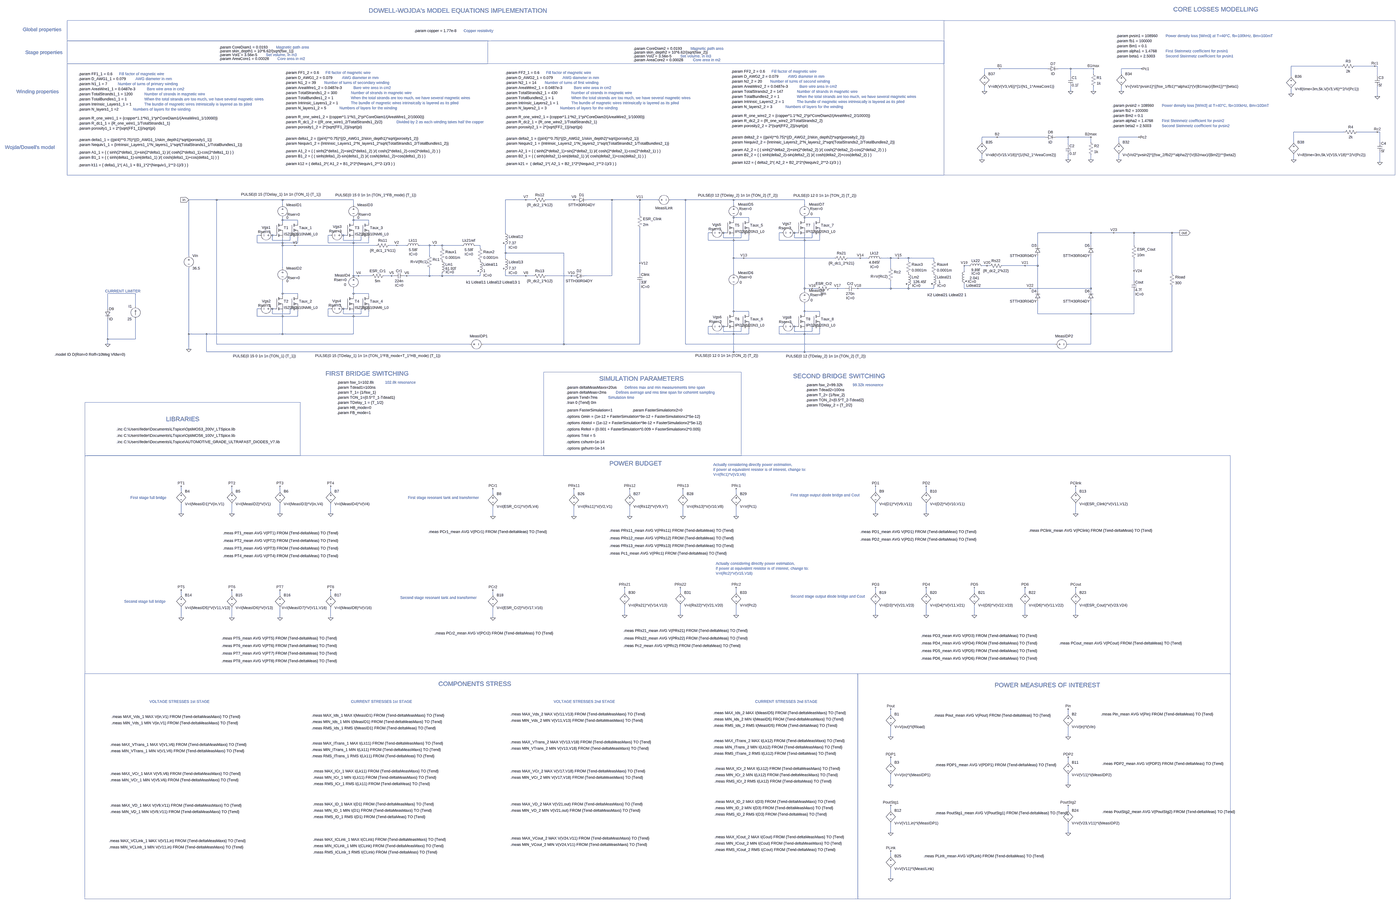
[diagram p0: schematic LLC_IPOS_quadratic_V14.asc, whole sheet]
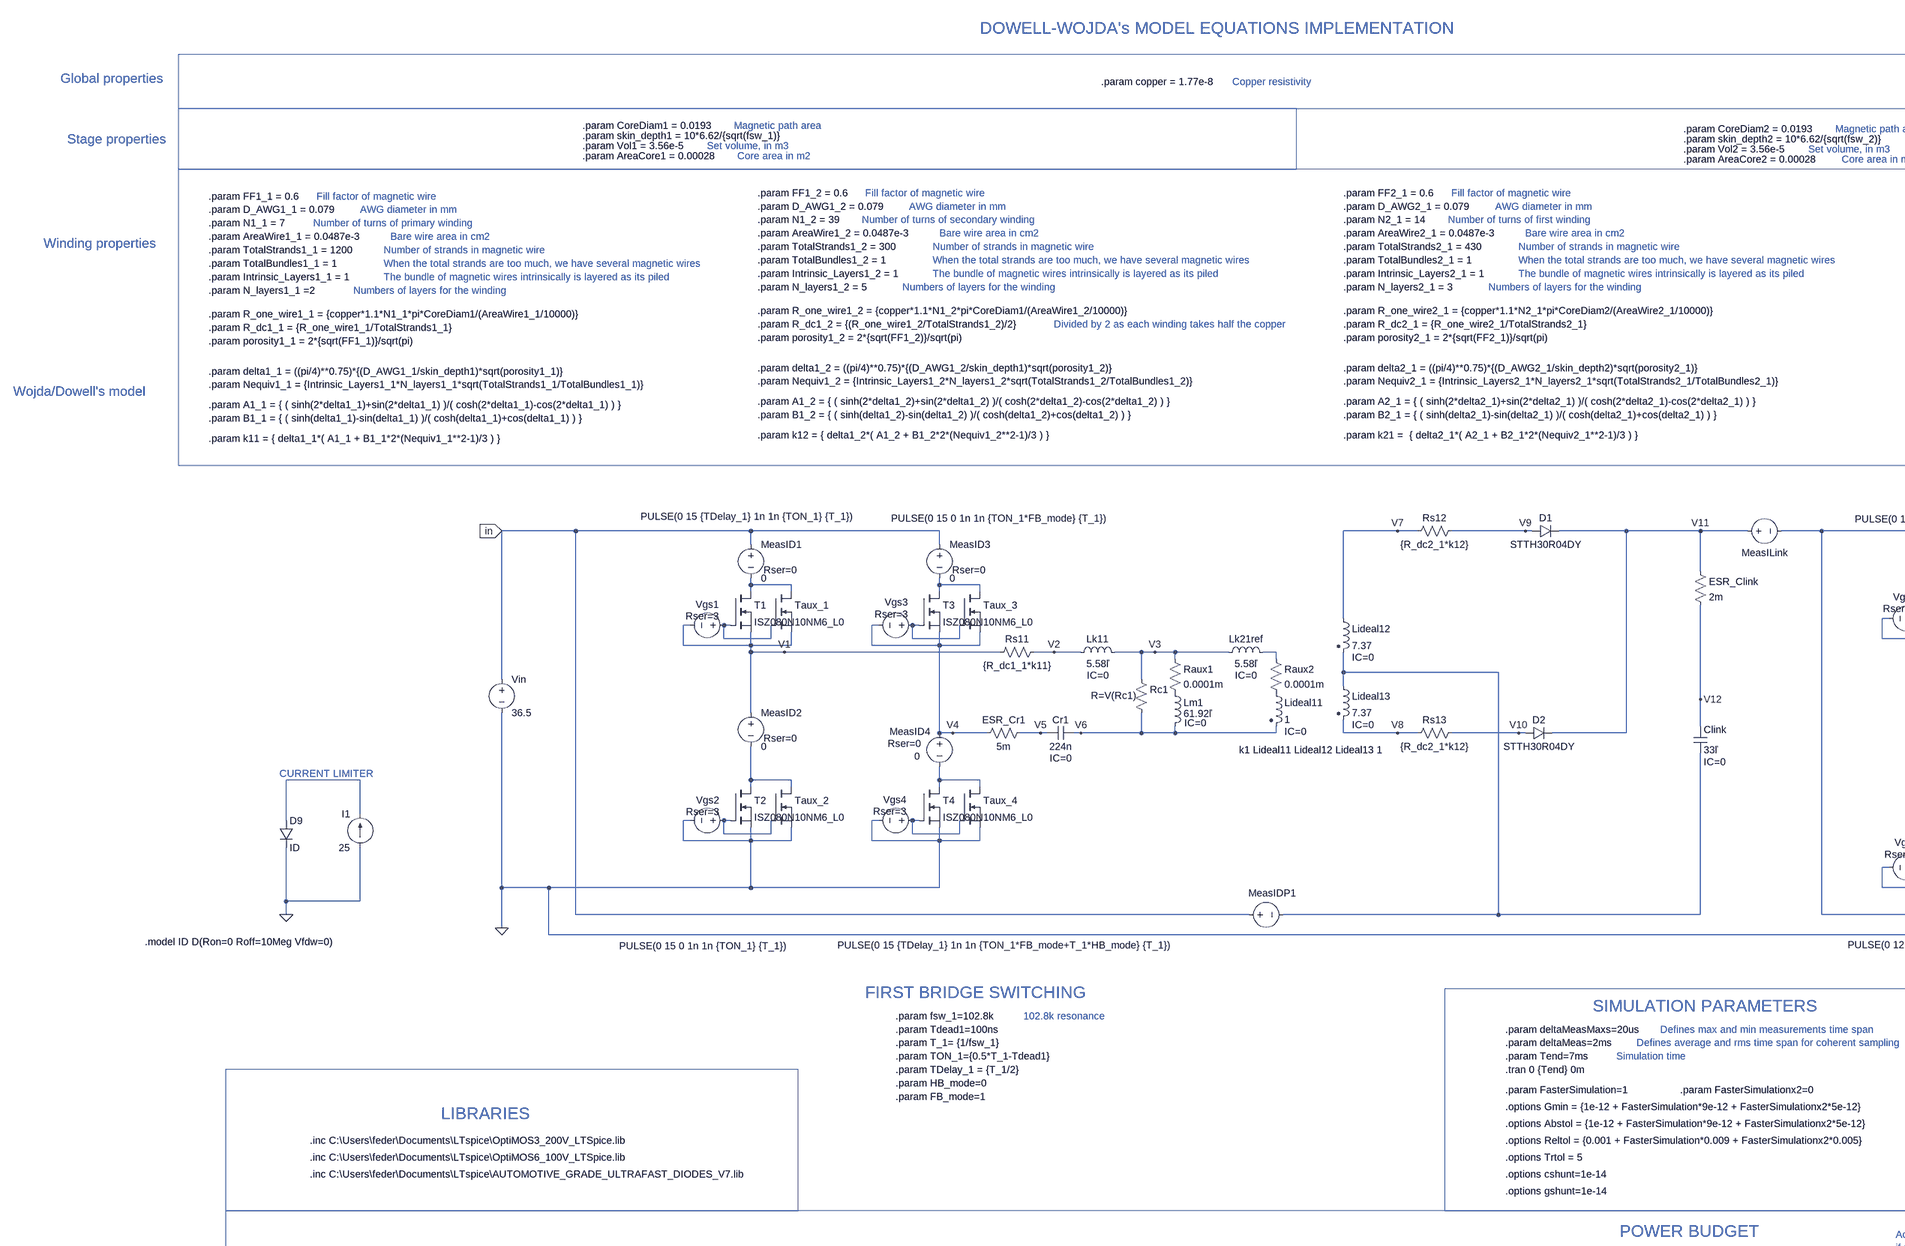
[diagram p1: schematic LLC_IPOS_quadratic_V14.asc, part, row 1 of 2, column 1 of 2]
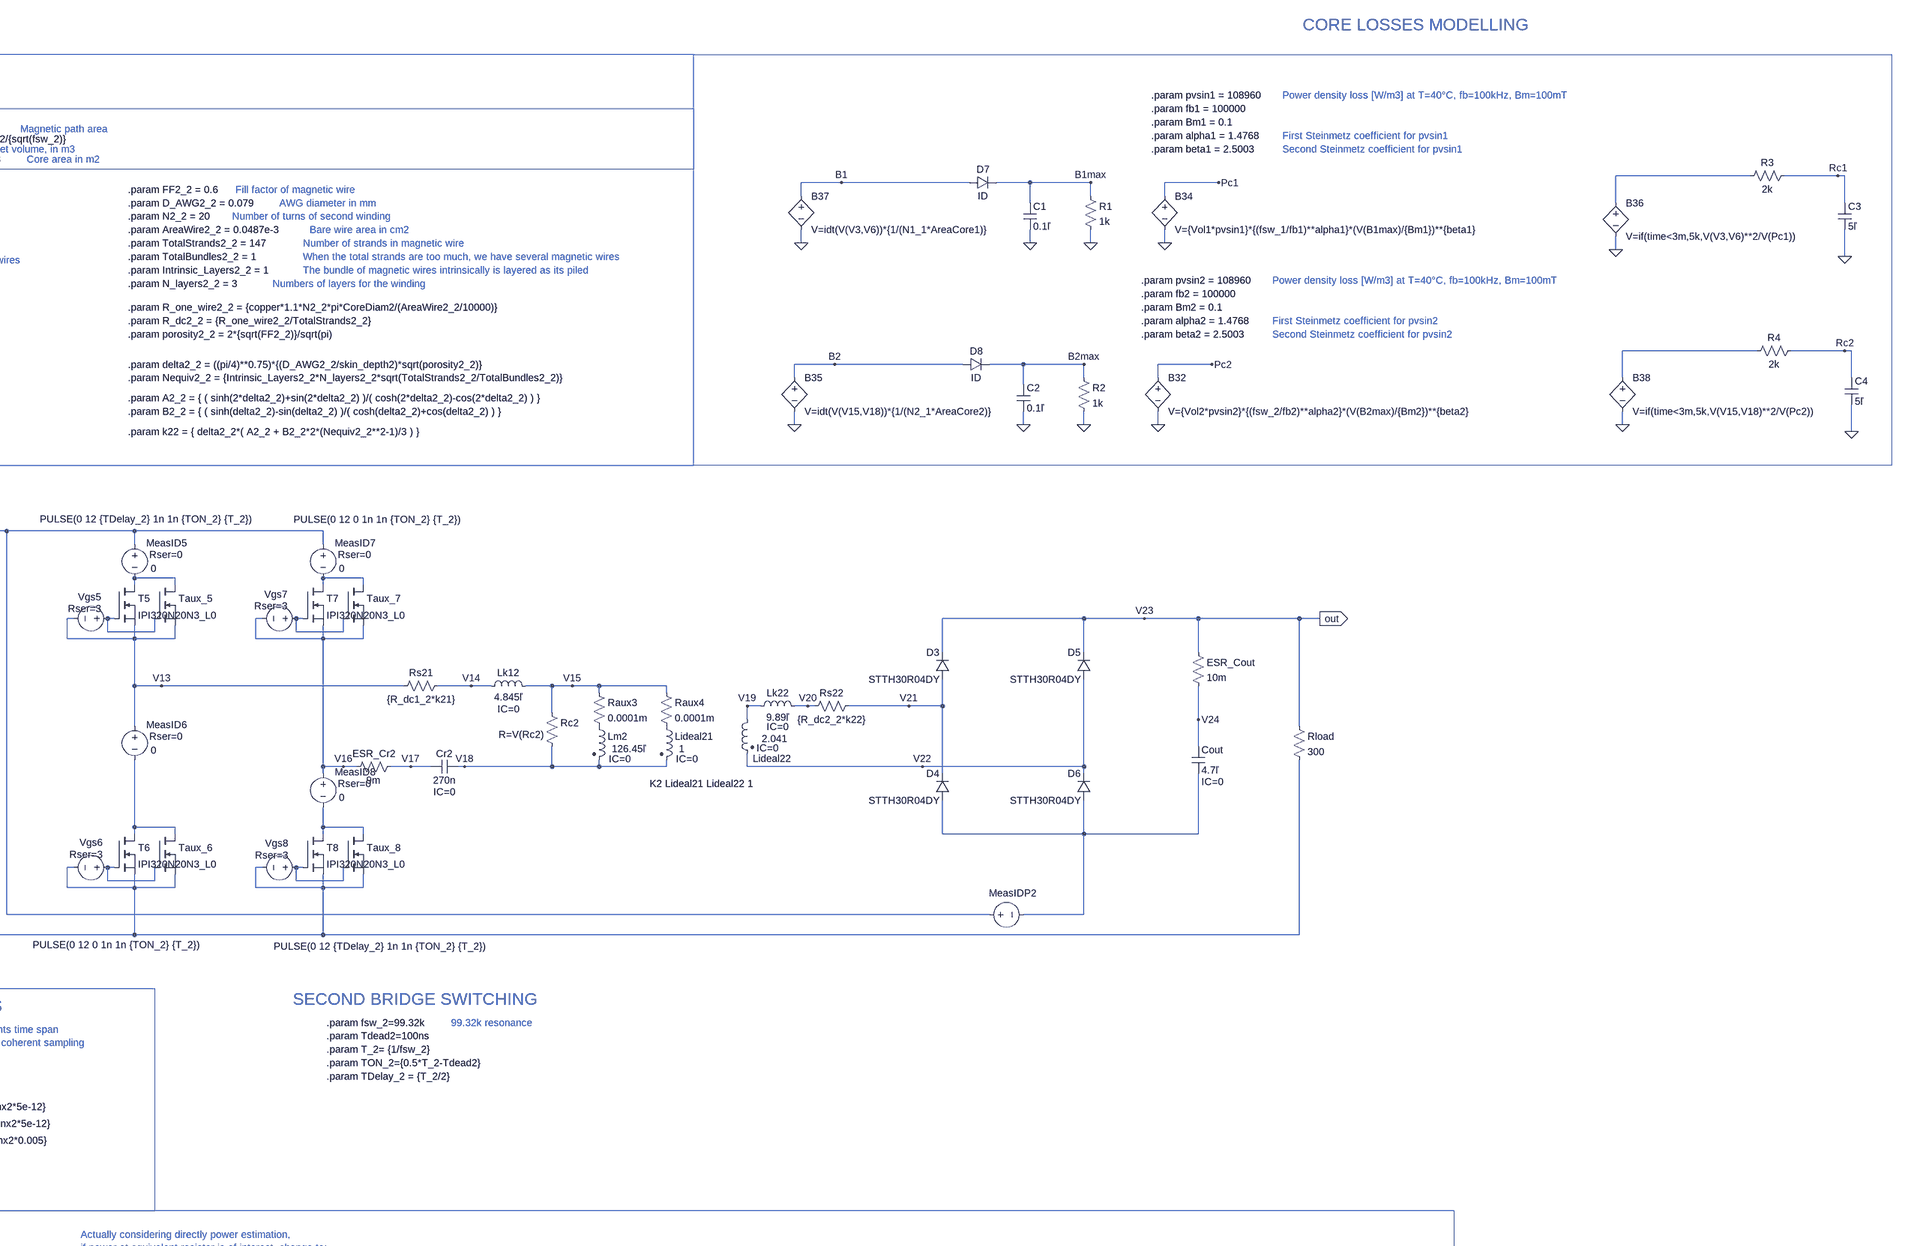
[diagram p2: schematic LLC_IPOS_quadratic_V14.asc, part, row 1 of 2, column 2 of 2]
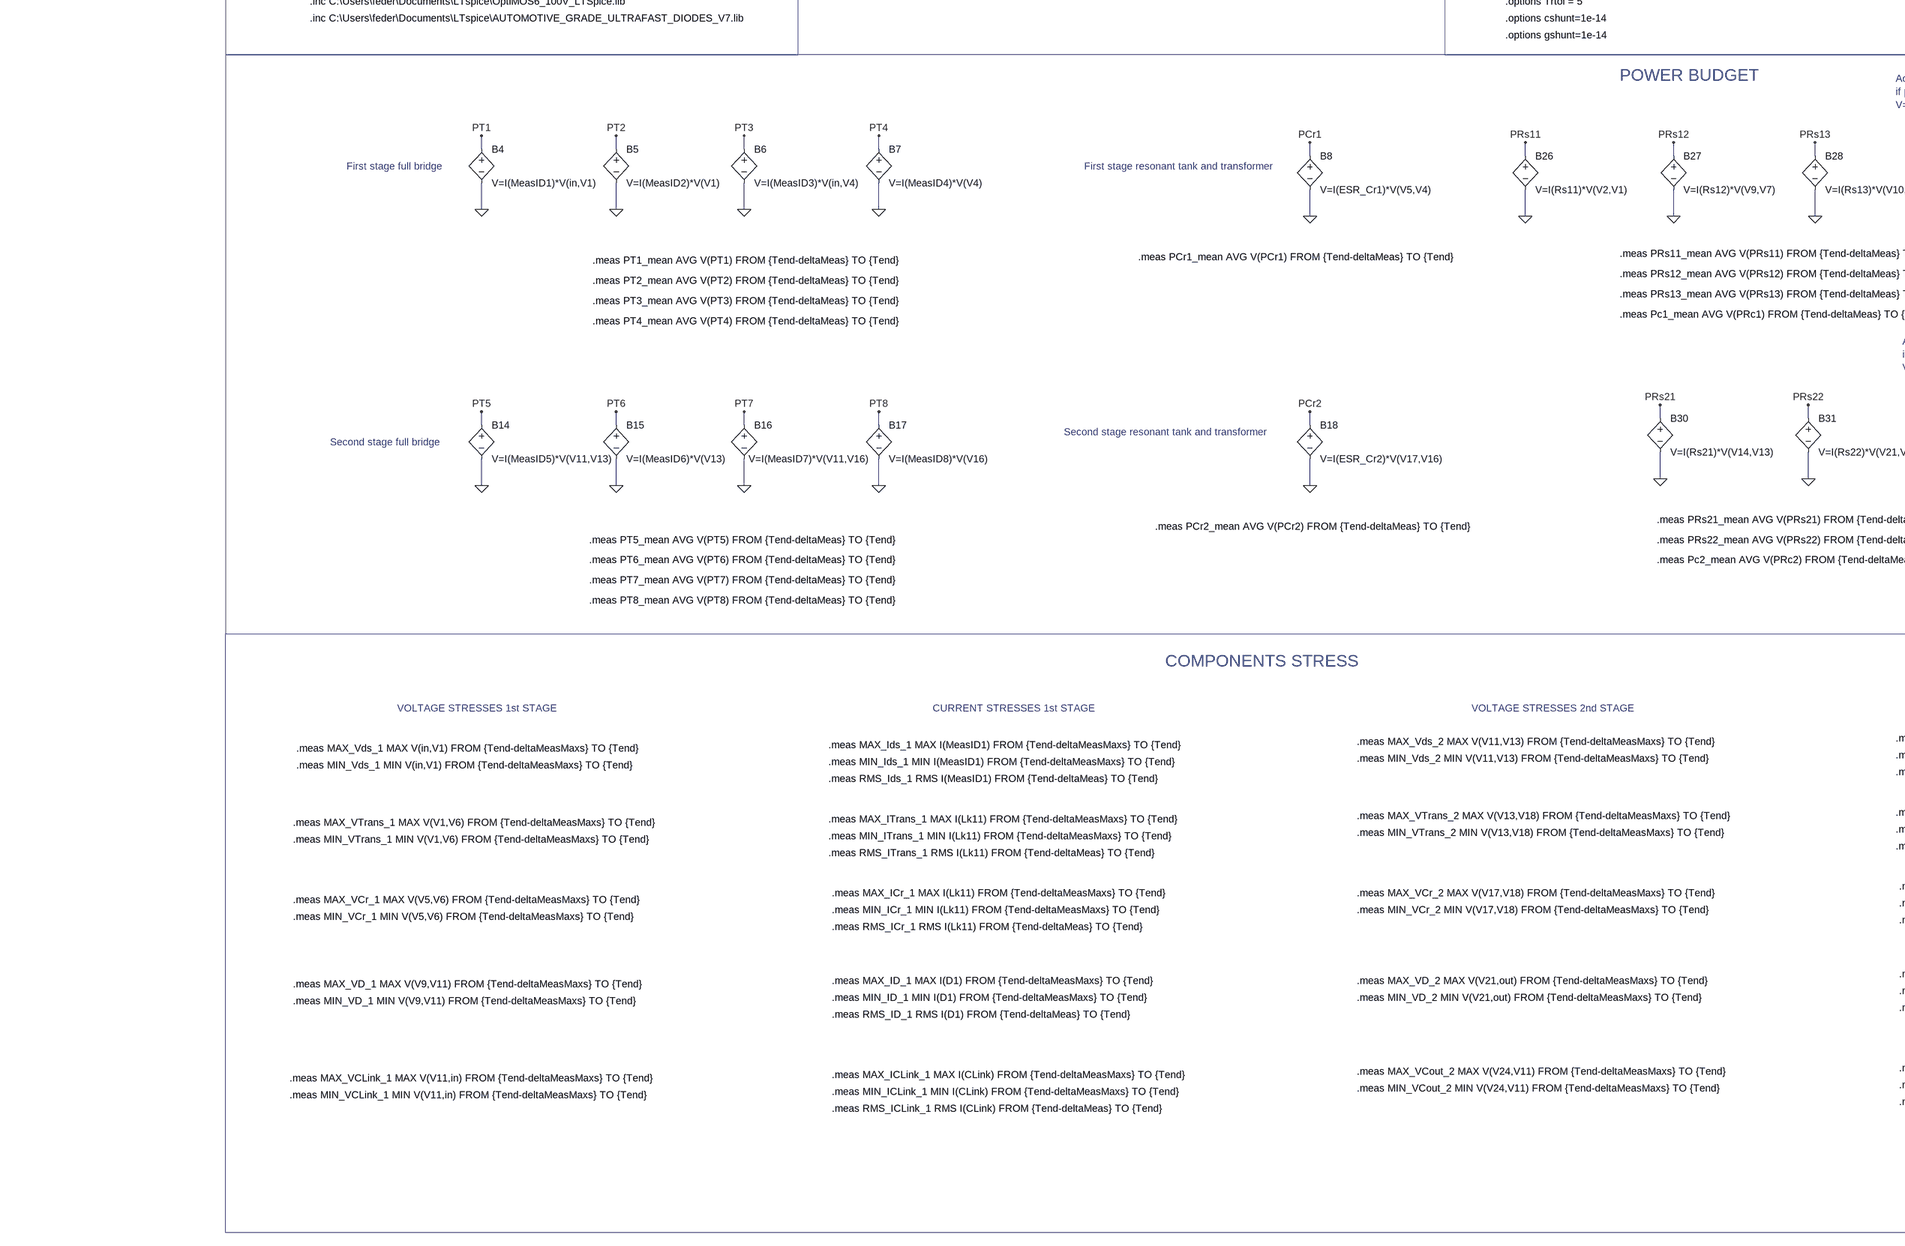
[diagram p3: schematic LLC_IPOS_quadratic_V14.asc, part, row 2 of 2, column 1 of 2]
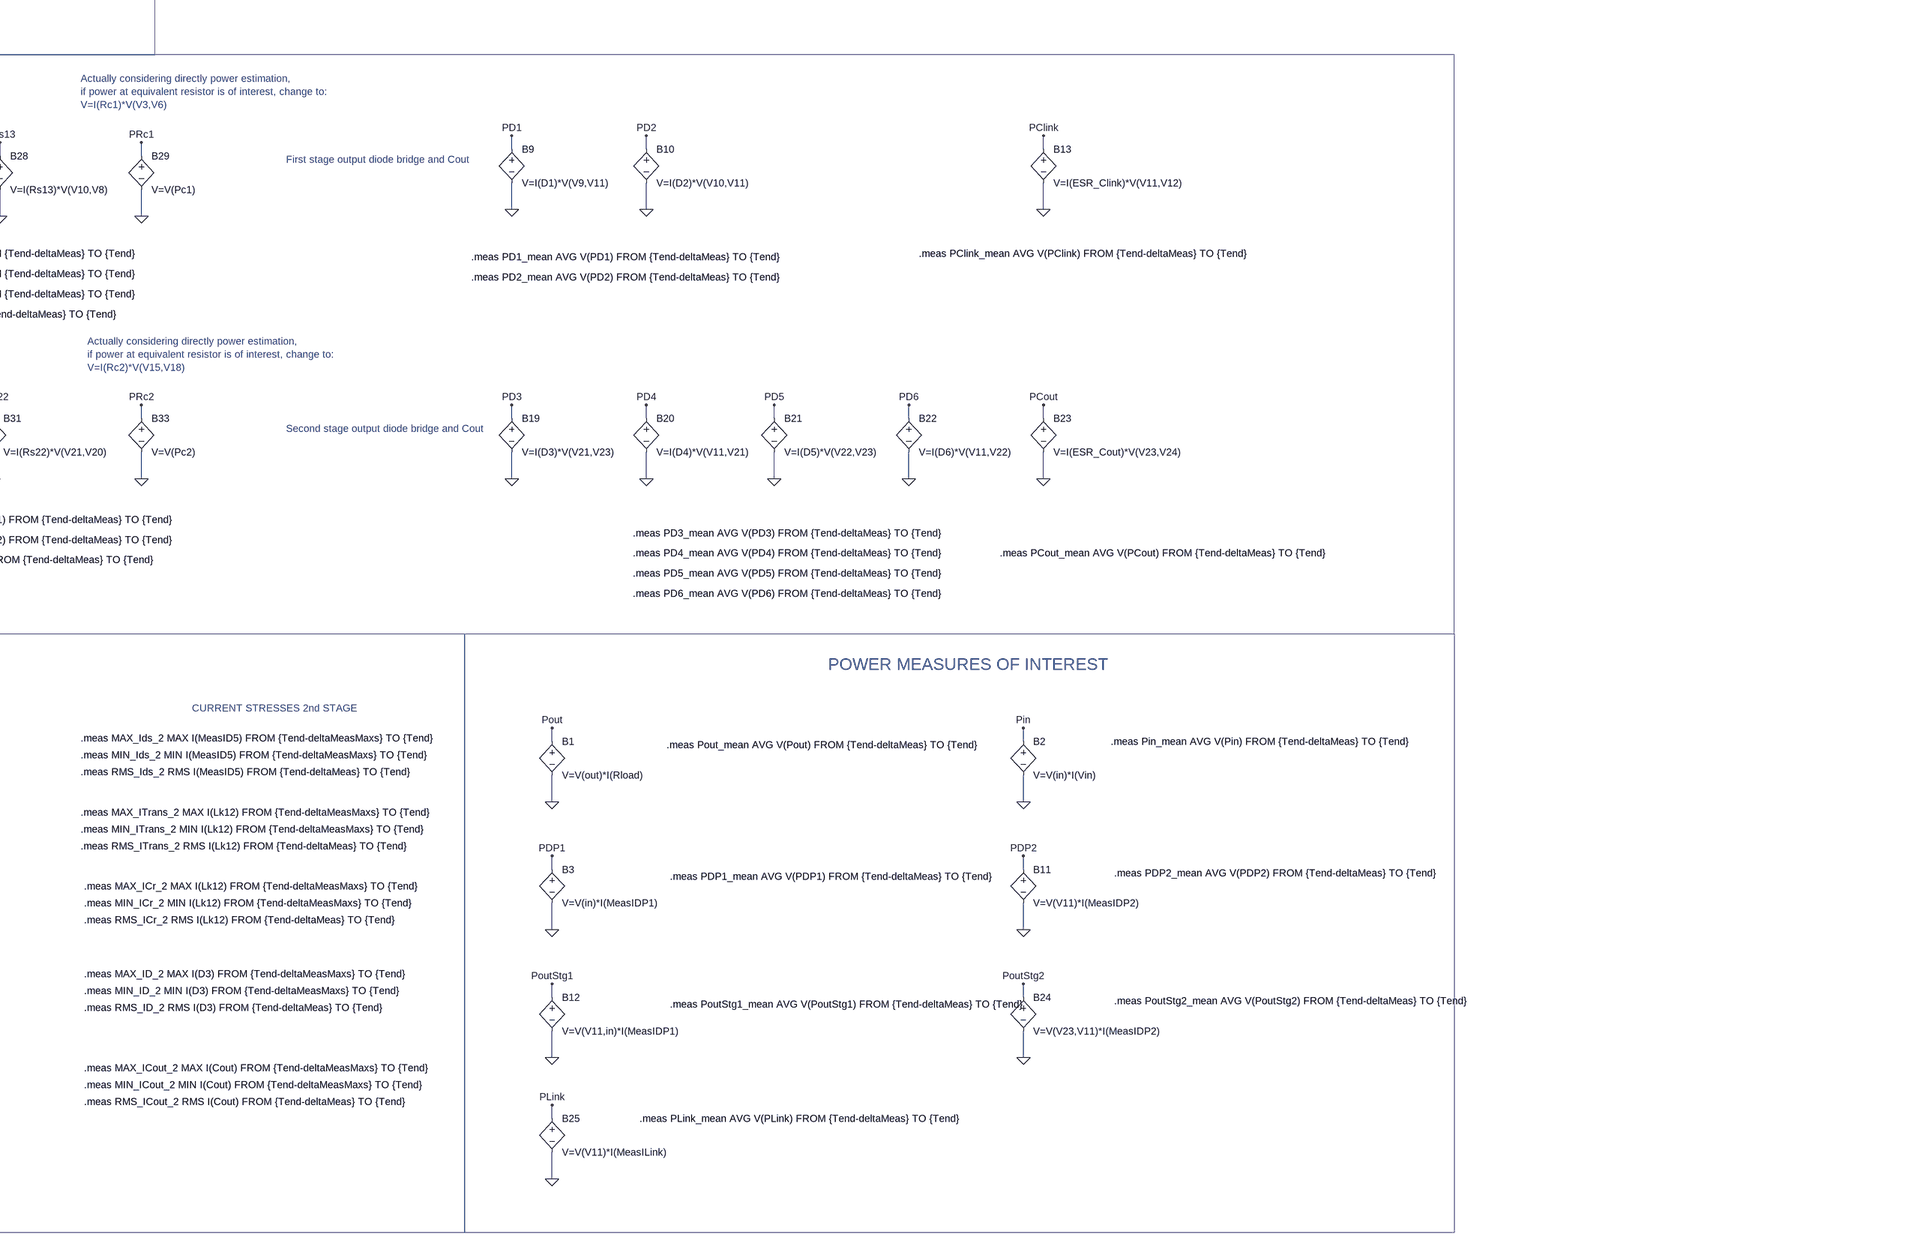
[diagram p4: schematic LLC_IPOS_quadratic_V14.asc, part, row 2 of 2, column 2 of 2]
* LLC_IPOS_quadratic_V14.asc
XT6 N019 N022 0 IPI320N20N3_L0  ; pins D G S
Vgs6 N022 0 PULSE(0 12 0 1n 1n {TON_2} {T_2}) Rser=3
Vin in 0 36.5
Rload V23 0 300
Cr2 V18 V17 270n IC=0
D3 V21 V23 STTH30R04DY
XT5 N004 N008 V13 IPI320N20N3_L0  ; pins D G S
XT7 N005 N009 V16 IPI320N20N3_L0  ; pins D G S
XT8 N020 N023 0 IPI320N20N3_L0  ; pins D G S
Lideal22 V19 V22 2.041 IC=0
Lideal21 P001 V18 1 IC=0
Vgs7 N009 V16 PULSE(0 12 0 1n 1n {TON_2} {T_2}) Rser=3
Vgs5 N008 V13 PULSE(0 12 {TDelay_2} 1n 1n {TON_2} {T_2}) Rser=3
Vgs8 N023 0 PULSE(0 12 {TDelay_2} 1n 1n {TON_2} {T_2}) Rser=3
D5 V22 V23 STTH30R04DY
D4 N021 V21 STTH30R04DY
D6 N021 V22 STTH30R04DY
Cout V24 N021 4.7ľ IC=0
B1 Pout 0 V=V(out)*I(Rload)
B2 Pin 0 V=V(in)*I(Vin)
XT2 N015 N017 0 ISZ080N10NM6_L0  ; pins D G S
Vgs2 N017 0 PULSE(0 15 0 1n 1n {TON_1} {T_1}) Rser=3
Cr1 V6 V5 224n IC=0
XT1 N006 N010 V1 ISZ080N10NM6_L0  ; pins D G S
XT3 N007 N011 V4 ISZ080N10NM6_L0  ; pins D G S
XT4 N016 N018 0 ISZ080N10NM6_L0  ; pins D G S
Vgs3 N011 V4 PULSE(0 15 0 1n 1n {TON_1*FB_mode} {T_1}) Rser=3
Vgs1 N010 V1 PULSE(0 15 {TDelay_1} 1n 1n {TON_1} {T_1}) Rser=3
Vgs4 N018 0 PULSE(0 15 {TDelay_1} 1n 1n {TON_1*FB_mode+T_1*HB_mode} {T_1}) Rser=3
Clink V12 N013 33ľ IC=0
D9 N014 0 ID
I1 0 N014 25
R§ESR_Clink V11 V12 2m
R§ESR_Cout V23 V24 10m
R§ESR_Cr1 V5 V4 5m
R§ESR_Cr2 V17 V16 9m
B4 PT1 0 V=I(MeasID1)*V(in,V1)
V§MeasID1 in N006 0 Rser=0
V§MeasID2 V1 N015 0 Rser=0
V§MeasID3 in N007 0 Rser=0
V§MeasID4 V4 N016 0 Rser=0
V§MeasID5 N003 N004 0 Rser=0
V§MeasID6 V13 N019 0 Rser=0
V§MeasID7 N003 N005 0 Rser=0
V§MeasID8 V16 N020 0 Rser=0
B5 PT2 0 V=I(MeasID2)*V(V1)
B6 PT3 0 V=I(MeasID3)*V(in,V4)
B7 PT4 0 V=I(MeasID4)*V(V4)
B8 PCr1 0 V=I(ESR_Cr1)*V(V5,V4)
B9 PD1 0 V=I(D1)*V(V9,V11)
B10 PD2 0 V=I(D2)*V(V10,V11)
B13 PClink 0 V=I(ESR_Clink)*V(V11,V12)
B14 PT5 0 V=I(MeasID5)*V(V11,V13)
B15 PT6 0 V=I(MeasID6)*V(V13)
B16 PT7 0 V=I(MeasID7)*V(V11,V16)
B17 PT8 0 V=I(MeasID8)*V(V16)
B18 PCr2 0 V=I(ESR_Cr2)*V(V17,V16)
B19 PD3 0 V=I(D3)*V(V21,V23)
B20 PD4 0 V=I(D4)*V(V11,V21)
B21 PD5 0 V=I(D5)*V(V22,V23)
B22 PD6 0 V=I(D6)*V(V11,V22)
B23 PCout 0 V=I(ESR_Cout)*V(V23,V24)
D1 V9 V11 STTH30R04DY
D2 V10 V11 STTH30R04DY
V§MeasIDP1 in N013 0 Rser=0
V§MeasIDP2 N003 N021 0 Rser=0
B3 PDP1 0 V=V(in)*I(MeasIDP1)
B11 PDP2 0 V=V(V11)*I(MeasIDP2)
B12 PoutStg1 0 V=V(V11,in)*I(MeasIDP1)
B24 PoutStg2 0 V=V(V23,V11)*I(MeasIDP2)
V§MeasILink V11 N003 0 Rser=0
B25 PLink 0 V=V(V11)*I(MeasILink)
Lk11 V2 V3 5.58ľ IC=0
Lm1 P002 V6 61.92ľ IC=0
Raux1 V3 P002 0.0001m
Lk21ref V3 N012 5.58ľ IC=0
Raux2 N012 P003 0.0001m
Lideal11 P003 V6 1 IC=0
Lideal12 V7 N013 7.37 IC=0
Lideal13 N013 V8 7.37 IC=0
Lk12 V14 V15 4.845ľ IC=0
Lm2 P004 V18 126.45ľ IC=0
Raux3 V15 P004 0.0001m
Raux4 V15 P001 0.0001m
Lk22 V19 V20 9.89ľ IC=0
Rs11 V2 V1 {R_dc1_1*k11}
Rs12 V9 V7 {R_dc2_1*k12}
Rs13 V10 V8 {R_dc2_1*k12}
Rs22 V21 V20 {R_dc2_2*k22}
Rc1 V3 V6 R=V(Rc1)
Rc2 V15 V18 R=V(Rc2)
Rs21 V14 V13 {R_dc1_2*k21}
B26 PRs11 0 V=I(Rs11)*V(V2,V1)
B27 PRs12 0 V=I(Rs12)*V(V9,V7)
B28 PRs13 0 V=I(Rs13)*V(V10,V8)
B29 PRc1 0 V=V(Pc1)
B30 PRs21 0 V=I(Rs21)*V(V14,V13)
B31 PRs22 0 V=I(Rs22)*V(V21,V20)
B33 PRc2 0 V=V(Pc2)
B34 Pc1 0 V={Vol1*pvsin1}*{(fsw_1/fb1)**alpha1}*(V(B1max)/{Bm1})**{beta1}
B37 B1 0 V=idt(V(V3,V6))*{1/(N1_1*AreaCore1)}
D7 B1 B1max ID
C1 B1max 0 0.1ľ
R1 B1max 0 1k
B32 Pc2 0 V={Vol2*pvsin2}*{(fsw_2/fb2)**alpha2}*(V(B2max)/{Bm2})**{beta2}
B35 B2 0 V=idt(V(V15,V18))*{1/(N2_1*AreaCore2)}
D8 B2 B2max ID
C2 B2max 0 0.1ľ
R2 B2max 0 1k
B36 N001 0 V=if(time<3m,5k,V(V3,V6)**2/V(Pc1))
R3 Rc1 N001 2k
C3 Rc1 0 5ľ
B38 N002 0 V=if(time<3m,5k,V(V15,V18)**2/V(Pc2))
R4 Rc2 N002 2k
C4 Rc2 0 5ľ
XTaux_1 N006 N010 V1 ISZ080N10NM6_L0  ; pins D G S
XTaux_3 N007 N011 V4 ISZ080N10NM6_L0  ; pins D G S
XTaux_2 N015 N017 0 ISZ080N10NM6_L0  ; pins D G S
XTaux_4 N016 N018 0 ISZ080N10NM6_L0  ; pins D G S
XTaux_5 N004 N008 V13 IPI320N20N3_L0  ; pins D G S
XTaux_7 N005 N009 V16 IPI320N20N3_L0  ; pins D G S
XTaux_6 N019 N022 0 IPI320N20N3_L0  ; pins D G S
XTaux_8 N020 N023 0 IPI320N20N3_L0  ; pins D G S
.model D D
.lib standard.dio
.inc C:\Users\feder\Documents\LTspice\OptiMOS3_200V_LTSpice.lib
.inc C:\Users\feder\Documents\LTspice\OptiMOS6_100V_LTSpice.lib
K2 Lideal21 Lideal22 1
.param fsw_1=102.8k
.param T_1= {1/fsw_1}
.param TON_1={0.5*T_1-Tdead1}
.param TDelay_1 = {T_1/2}
.param T_2= {1/fsw_2}
.param TON_2={0.5*T_2-Tdead2}
.param TDelay_2 = {T_2/2}
.param fsw_2=99.32k
.param HB_mode=0
.param FB_mode=1
.model ID D(Ron=0 Roff=10Meg Vfdw=0)
* POWER BUDGET
* CURRENT LIMITER
* First stage full bridge
* First stage resonant tank and transformer
* First stage output diode bridge and Cout
* Second stage full bridge
* Second stage resonant tank and transformer
* Second stage output diode bridge and Cout
.meas PT1_mean AVG V(PT1) FROM {Tend-deltaMeas} TO {Tend}
.meas PT2_mean AVG V(PT2) FROM {Tend-deltaMeas} TO {Tend}
.meas PT3_mean AVG V(PT3) FROM {Tend-deltaMeas} TO {Tend}
.meas PT4_mean AVG V(PT4) FROM {Tend-deltaMeas} TO {Tend}
.meas PT5_mean AVG V(PT5) FROM {Tend-deltaMeas} TO {Tend}
.meas PT6_mean AVG V(PT6) FROM {Tend-deltaMeas} TO {Tend}
.meas PT7_mean AVG V(PT7) FROM {Tend-deltaMeas} TO {Tend}
.meas PT8_mean AVG V(PT8) FROM {Tend-deltaMeas} TO {Tend}
.meas PCr1_mean AVG V(PCr1) FROM {Tend-deltaMeas} TO {Tend}
.meas PCr2_mean AVG V(PCr2) FROM {Tend-deltaMeas} TO {Tend}
.meas PD1_mean AVG V(PD1) FROM {Tend-deltaMeas} TO {Tend}
.meas PD2_mean AVG V(PD2) FROM {Tend-deltaMeas} TO {Tend}
.meas PD3_mean AVG V(PD3) FROM {Tend-deltaMeas} TO {Tend}
.meas PD4_mean AVG V(PD4) FROM {Tend-deltaMeas} TO {Tend}
.meas PD5_mean AVG V(PD5) FROM {Tend-deltaMeas} TO {Tend}
.meas PD6_mean AVG V(PD6) FROM {Tend-deltaMeas} TO {Tend}
.meas PClink_mean AVG V(PClink) FROM {Tend-deltaMeas} TO {Tend}
.meas PCout_mean AVG V(PCout) FROM {Tend-deltaMeas} TO {Tend}
.meas Pout_mean AVG V(Pout) FROM {Tend-deltaMeas} TO {Tend}
.meas Pin_mean AVG V(Pin) FROM {Tend-deltaMeas} TO {Tend}
.param Tdead1=100ns
.param Tdead2=100ns
.tran 0 {Tend} 0m
.param Tend=7ms
.param FasterSimulation=1
* POWER MEASURES OF INTEREST
.meas PDP1_mean AVG V(PDP1) FROM {Tend-deltaMeas} TO {Tend}
.meas PDP2_mean AVG V(PDP2) FROM {Tend-deltaMeas} TO {Tend}
.meas PoutStg1_mean AVG V(PoutStg1) FROM {Tend-deltaMeas} TO {Tend}
.meas PoutStg2_mean AVG V(PoutStg2) FROM {Tend-deltaMeas} TO {Tend}
.param deltaMeas=2ms
* Defines average and rms time span for coherent sampling
.meas PLink_mean AVG V(PLink) FROM {Tend-deltaMeas} TO {Tend}
* VOLTAGE STRESSES 1st STAGE
.meas MAX_Vds_1 MAX V(in,V1) FROM {Tend-deltaMeasMaxs} TO {Tend}
.meas MIN_Vds_1 MIN V(in,V1) FROM {Tend-deltaMeasMaxs} TO {Tend}
.meas MAX_VTrans_1 MAX V(V1,V6) FROM {Tend-deltaMeasMaxs} TO {Tend}
.meas MIN_VTrans_1 MIN V(V1,V6) FROM {Tend-deltaMeasMaxs} TO {Tend}
.meas MAX_VCr_1 MAX V(V5,V6) FROM {Tend-deltaMeasMaxs} TO {Tend}
.meas MIN_VCr_1 MIN V(V5,V6) FROM {Tend-deltaMeasMaxs} TO {Tend}
.meas MAX_VD_1 MAX V(V9,V11) FROM {Tend-deltaMeasMaxs} TO {Tend}
.meas MIN_VD_1 MIN V(V9,V11) FROM {Tend-deltaMeasMaxs} TO {Tend}
.meas MAX_VCLink_1 MAX V(V11,in) FROM {Tend-deltaMeasMaxs} TO {Tend}
.meas MIN_VCLink_1 MIN V(V11,in) FROM {Tend-deltaMeasMaxs} TO {Tend}
.meas MAX_Vds_2 MAX V(V11,V13) FROM {Tend-deltaMeasMaxs} TO {Tend}
.meas MIN_Vds_2 MIN V(V11,V13) FROM {Tend-deltaMeasMaxs} TO {Tend}
.meas MAX_VTrans_2 MAX V(V13,V18) FROM {Tend-deltaMeasMaxs} TO {Tend}
.meas MIN_VTrans_2 MIN V(V13,V18) FROM {Tend-deltaMeasMaxs} TO {Tend}
.meas MAX_VCr_2 MAX V(V17,V18) FROM {Tend-deltaMeasMaxs} TO {Tend}
.meas MIN_VCr_2 MIN V(V17,V18) FROM {Tend-deltaMeasMaxs} TO {Tend}
.meas MAX_VD_2 MAX V(V21,out) FROM {Tend-deltaMeasMaxs} TO {Tend}
.meas MIN_VD_2 MIN V(V21,out) FROM {Tend-deltaMeasMaxs} TO {Tend}
.meas MAX_VCout_2 MAX V(V24,V11) FROM {Tend-deltaMeasMaxs} TO {Tend}
.meas MIN_VCout_2 MIN V(V24,V11) FROM {Tend-deltaMeasMaxs} TO {Tend}
.param deltaMeasMaxs=20us
* Defines max and min measurements time span
* CURRENT STRESSES 1st STAGE
.meas MAX_Ids_1 MAX I(MeasID1) FROM {Tend-deltaMeasMaxs} TO {Tend}
.meas MIN_Ids_1 MIN I(MeasID1) FROM {Tend-deltaMeasMaxs} TO {Tend}
.meas RMS_Ids_1 RMS I(MeasID1) FROM {Tend-deltaMeas} TO {Tend}
.meas MAX_ITrans_1 MAX I(Lk11) FROM {Tend-deltaMeasMaxs} TO {Tend}
.meas MIN_ITrans_1 MIN I(Lk11) FROM {Tend-deltaMeasMaxs} TO {Tend}
.meas RMS_ITrans_1 RMS I(Lk11) FROM {Tend-deltaMeas} TO {Tend}
.meas MAX_ICr_1 MAX I(Lk11) FROM {Tend-deltaMeasMaxs} TO {Tend}
.meas MIN_ICr_1 MIN I(Lk11) FROM {Tend-deltaMeasMaxs} TO {Tend}
.meas RMS_ICr_1 RMS I(Lk11) FROM {Tend-deltaMeas} TO {Tend}
.meas MAX_ID_1 MAX I(D1) FROM {Tend-deltaMeasMaxs} TO {Tend}
.meas MIN_ID_1 MIN I(D1) FROM {Tend-deltaMeasMaxs} TO {Tend}
.meas RMS_ID_1 RMS I(D1) FROM {Tend-deltaMeas} TO {Tend}
.meas MAX_ICLink_1 MAX I(CLink) FROM {Tend-deltaMeasMaxs} TO {Tend}
.meas MIN_ICLink_1 MIN I(CLink) FROM {Tend-deltaMeasMaxs} TO {Tend}
.meas RMS_ICLink_1 RMS I(CLink) FROM {Tend-deltaMeas} TO {Tend}
* VOLTAGE STRESSES 2nd STAGE
* CURRENT STRESSES 2nd STAGE
.meas MAX_Ids_2 MAX I(MeasID5) FROM {Tend-deltaMeasMaxs} TO {Tend}
.meas MIN_Ids_2 MIN I(MeasID5) FROM {Tend-deltaMeasMaxs} TO {Tend}
.meas RMS_Ids_2 RMS I(MeasID5) FROM {Tend-deltaMeas} TO {Tend}
.meas MAX_ITrans_2 MAX I(Lk12) FROM {Tend-deltaMeasMaxs} TO {Tend}
.meas MIN_ITrans_2 MIN I(Lk12) FROM {Tend-deltaMeasMaxs} TO {Tend}
.meas RMS_ITrans_2 RMS I(Lk12) FROM {Tend-deltaMeas} TO {Tend}
.meas MAX_ICr_2 MAX I(Lk12) FROM {Tend-deltaMeasMaxs} TO {Tend}
.meas MIN_ICr_2 MIN I(Lk12) FROM {Tend-deltaMeasMaxs} TO {Tend}
.meas RMS_ICr_2 RMS I(Lk12) FROM {Tend-deltaMeas} TO {Tend}
.meas MAX_ID_2 MAX I(D3) FROM {Tend-deltaMeasMaxs} TO {Tend}
.meas MIN_ID_2 MIN I(D3) FROM {Tend-deltaMeasMaxs} TO {Tend}
.meas RMS_ID_2 RMS I(D3) FROM {Tend-deltaMeas} TO {Tend}
.meas MAX_ICout_2 MAX I(Cout) FROM {Tend-deltaMeasMaxs} TO {Tend}
.meas MIN_ICout_2 MIN I(Cout) FROM {Tend-deltaMeasMaxs} TO {Tend}
.meas RMS_ICout_2 RMS I(Cout) FROM {Tend-deltaMeas} TO {Tend}
.options Gmin = {1e-12 + FasterSimulation*9e-12 + FasterSimulationx2*5e-12}
.options Abstol = {1e-12 + FasterSimulation*9e-12 + FasterSimulationx2*5e-12}
.options Reltol = {0.001 + FasterSimulation*0.009 + FasterSimulationx2*0.005}
.param FasterSimulationx2=0
.inc C:\Users\feder\Documents\LTspice\AUTOMOTIVE_GRADE_ULTRAFAST_DIODES_V7.lib
k1 Lideal11 Lideal12 Lideal13 1
* SIMULATION PARAMETERS
* COMPONENTS STRESS
* FIRST BRIDGE SWITCHING
* SECOND BRIDGE SWITCHING
* LIBRARIES
* DOWELL-WOJDA's MODEL EQUATIONS IMPLEMENTATION
.param N1_1 = 7
.param TotalStrands1_1 = 1200
.param R_one_wire1_1 = {copper*1.1*N1_1*pi*CoreDiam1/(AreaWire1_1/10000)}
.param CoreDiam1 = 0.0193
.param copper = 1.77e-8
* Copper resistivity
* Magnetic path area
* Number of turns of primary winding
* Number of strands in magnetic wire
.param R_dc1_1 = {R_one_wire1_1/TotalStrands1_1}
.param D_AWG1_1 = 0.079
* AWG diameter in mm
.param FF1_1 = 0.6
* Fill factor of magnetic wire
.param porosity1_1 = 2*{sqrt(FF1_1)}/sqrt(pi)
.param delta1_1 = ((pi/4)**0.75)*{(D_AWG1_1/skin_depth1)*sqrt(porosity1_1)}
.param Nequiv1_1 = {Intrinsic_Layers1_1*N_layers1_1*sqrt(TotalStrands1_1/TotalBundles1_1)}
.param AreaWire1_1 = 0.0487e-3
* Bare wire area in cm2
.param TotalBundles1_1 = 1
.param Intrinsic_Layers1_1 = 1
* When the total strands are too much, we have several magnetic wires
* The bundle of magnetic wires intrinsically is layered as its piled
.param N_layers1_1 =2
* Numbers of layers for the winding
.param A1_1 = { ( sinh(2*delta1_1)+sin(2*delta1_1) )/( cosh(2*delta1_1)-cos(2*delta1_1) ) }
.param B1_1 = { ( sinh(delta1_1)-sin(delta1_1) )/( cosh(delta1_1)+cos(delta1_1) ) }
.param k11 = { delta1_1*( A1_1 + B1_1*2*(Nequiv1_1**2-1)/3 ) }
* Global properties
* Winding properties
* Stage properties
.param N1_2 = 39
.param TotalStrands1_2 = 300
.param R_one_wire1_2 = {copper*1.1*N1_2*pi*CoreDiam1/(AreaWire1_2/10000)}
* Number of turns of secondary winding
* Number of strands in magnetic wire
.param R_dc1_2 = {(R_one_wire1_2/TotalStrands1_2)/2}
.param D_AWG1_2 = 0.079
* AWG diameter in mm
.param FF1_2 = 0.6
* Fill factor of magnetic wire
.param porosity1_2 = 2*{sqrt(FF1_2)}/sqrt(pi)
.param delta1_2 = ((pi/4)**0.75)*{(D_AWG1_2/skin_depth1)*sqrt(porosity1_2)}
.param Nequiv1_2 = {Intrinsic_Layers1_2*N_layers1_2*sqrt(TotalStrands1_2/TotalBundles1_2)}
.param AreaWire1_2 = 0.0487e-3
* Bare wire area in cm2
.param TotalBundles1_2 = 1
.param Intrinsic_Layers1_2 = 1
* When the total strands are too much, we have several magnetic wires
* The bundle of magnetic wires intrinsically is layered as its piled
.param N_layers1_2 = 5
* Numbers of layers for the winding
.param A1_2 = { ( sinh(2*delta1_2)+sin(2*delta1_2) )/( cosh(2*delta1_2)-cos(2*delta1_2) ) }
.param B1_2 = { ( sinh(delta1_2)-sin(delta1_2) )/( cosh(delta1_2)+cos(delta1_2) ) }
.param k12 = { delta1_2*( A1_2 + B1_2*2*(Nequiv1_2**2-1)/3 ) }
* Divided by 2 as each winding takes half the copper
.param skin_depth1 = 10*6.62/{sqrt(fsw_1)}
.param N2_1 = 14
.param TotalStrands2_1 = 430
.param R_one_wire2_1 = {copper*1.1*N2_1*pi*CoreDiam2/(AreaWire2_1/10000)}
* Number of turns of first winding
* Number of strands in magnetic wire
.param R_dc2_1 = {R_one_wire2_1/TotalStrands2_1}
.param D_AWG2_1 = 0.079
* AWG diameter in mm
.param FF2_1 = 0.6
* Fill factor of magnetic wire
.param porosity2_1 = 2*{sqrt(FF2_1)}/sqrt(pi)
.param delta2_1 = ((pi/4)**0.75)*{(D_AWG2_1/skin_depth2)*sqrt(porosity2_1)}
.param Nequiv2_1 = {Intrinsic_Layers2_1*N_layers2_1*sqrt(TotalStrands2_1/TotalBundles2_1)}
.param AreaWire2_1 = 0.0487e-3
* Bare wire area in cm2
.param TotalBundles2_1 = 1
.param Intrinsic_Layers2_1 = 1
* When the total strands are too much, we have several magnetic wires
* The bundle of magnetic wires intrinsically is layered as its piled
.param N_layers2_1 = 3
* Numbers of layers for the winding
.param A2_1 = { ( sinh(2*delta2_1)+sin(2*delta2_1) )/( cosh(2*delta2_1)-cos(2*delta2_1) ) }
.param B2_1 = { ( sinh(delta2_1)-sin(delta2_1) )/( cosh(delta2_1)+cos(delta2_1) ) }
.param k21 =  { delta2_1*( A2_1 + B2_1*2*(Nequiv2_1**2-1)/3 ) }
.param CoreDiam2 = 0.0193
* Magnetic path area
.param skin_depth2 = 10*6.62/{sqrt(fsw_2)}
.param N2_2 = 20
.param TotalStrands2_2 = 147
.param R_one_wire2_2 = {copper*1.1*N2_2*pi*CoreDiam2/(AreaWire2_2/10000)}
* Number of turns of second winding
* Number of strands in magnetic wire
.param R_dc2_2 = {R_one_wire2_2/TotalStrands2_2}
.param D_AWG2_2 = 0.079
* AWG diameter in mm
.param FF2_2 = 0.6
* Fill factor of magnetic wire
.param porosity2_2 = 2*{sqrt(FF2_2)}/sqrt(pi)
.param delta2_2 = ((pi/4)**0.75)*{(D_AWG2_2/skin_depth2)*sqrt(porosity2_2)}
.param Nequiv2_2 = {Intrinsic_Layers2_2*N_layers2_2*sqrt(TotalStrands2_2/TotalBundles2_2)}
.param AreaWire2_2 = 0.0487e-3
* Bare wire area in cm2
.param TotalBundles2_2 = 1
.param Intrinsic_Layers2_2 = 1
* When the total strands are too much, we have several magnetic wires
* The bundle of magnetic wires intrinsically is layered as its piled
.param N_layers2_2 = 3
* Numbers of layers for the winding
.param A2_2 = { ( sinh(2*delta2_2)+sin(2*delta2_2) )/( cosh(2*delta2_2)-cos(2*delta2_2) ) }
.param B2_2 = { ( sinh(delta2_2)-sin(delta2_2) )/( cosh(delta2_2)+cos(delta2_2) ) }
.param k22 = { delta2_2*( A2_2 + B2_2*2*(Nequiv2_2**2-1)/3 ) }
.meas PRs11_mean AVG V(PRs11) FROM {Tend-deltaMeas} TO {Tend}
.meas PRs12_mean AVG V(PRs12) FROM {Tend-deltaMeas} TO {Tend}
.meas PRs13_mean AVG V(PRs13) FROM {Tend-deltaMeas} TO {Tend}
.meas Pc1_mean AVG V(PRc1) FROM {Tend-deltaMeas} TO {Tend}
.meas PRs21_mean AVG V(PRs21) FROM {Tend-deltaMeas} TO {Tend}
.meas PRs22_mean AVG V(PRs22) FROM {Tend-deltaMeas} TO {Tend}
.meas Pc2_mean AVG V(PRc2) FROM {Tend-deltaMeas} TO {Tend}
.param Vol1 = 3.56e-5
* Set volume, in m3
.param Vol2 = 3.56e-5
* Set volume, in m3
* Wojda/Dowell's model
.param pvsin1 = 108960
* Power density loss [W/m3] at T=40°C, fb=100kHz, Bm=100mT
.param fb1 = 100000
.param Bm1 = 0.1
.param alpha1 = 1.4768
* First Steinmetz coefficient for pvsin1
.param beta1 = 2.5003
* Second Steinmetz coefficient for pvsin1
.param AreaCore1 = 0.00028
* Core area in m2
.param AreaCore2 = 0.00028
* Core area in m2
.param pvsin2 = 108960
* Power density loss [W/m3] at T=40°C, fb=100kHz, Bm=100mT
.param fb2 = 100000
.param Bm2 = 0.1
.param alpha2 = 1.4768
* First Steinmetz coefficient for pvsin2
.param beta2 = 2.5003
* Second Steinmetz coefficient for pvsin2
* CORE LOSSES MODELLING
* 99.32k resonance
* 102.8k resonance
.options cshunt=1e-14
.options gshunt=1e-14
* Simulation time
.options Trtol = 5
* Actually considering directly power estimation,
* if power at equivalent resistor is of interest, change to:
* V=I(Rc2)*V(V15,V18)
* Actually considering directly power estimation,
* if power at equivalent resistor is of interest, change to:
* V=I(Rc1)*V(V3,V6)
.backanno
.end